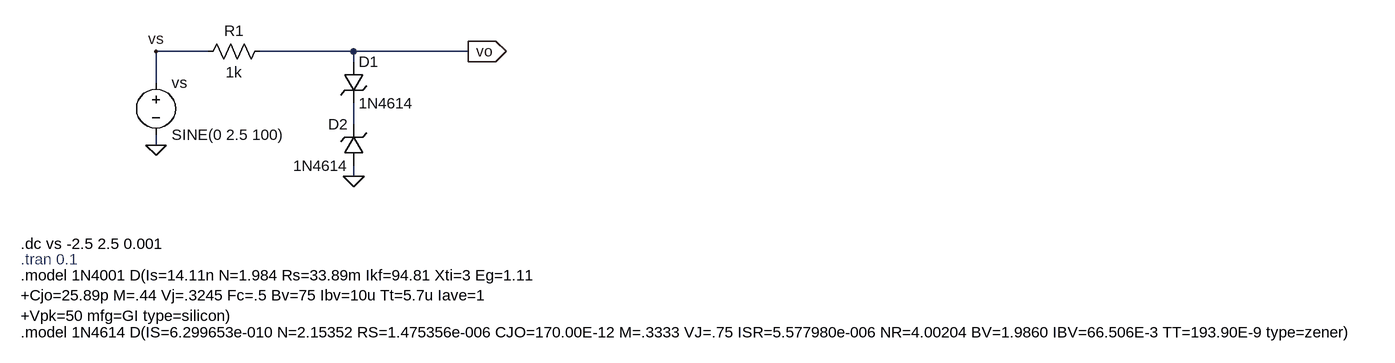
[diagram p0: schematic Lab6p4.asc]
Lab6p4.asc, the LTspice schematic file:
Version 4
SHEET 1 2280 680
WIRE 288 16 208 16
WIRE 512 16 368 16
WIRE 688 16 512 16
WIRE 512 32 512 16
WIRE 208 64 208 16
WIRE 512 128 512 96
WIRE 208 160 208 144
WIRE 512 208 512 192
FLAG 208 160 0
FLAG 688 16 vo
IOPIN 688 16 Out
FLAG 208 16 vs
FLAG 512 208 0
SYMBOL voltage 208 48 R0
WINDOW 123 0 0 Left 0
WINDOW 39 0 0 Left 0
SYMATTR InstName vs
SYMATTR Value SINE(0 2.5 100)
SYMBOL res 384 0 R90
WINDOW 0 0 56 VBottom 2
WINDOW 3 32 56 VTop 2
SYMATTR InstName R1
SYMATTR Value 1k
SYMBOL zener 496 32 R0
SYMATTR InstName D1
SYMATTR Value 1N4614
SYMBOL zener 528 192 R180
WINDOW 0 24 64 Left 2
WINDOW 3 24 0 Left 2
SYMATTR InstName D2
SYMATTR Value 1N4614
TEXT 0 360 Left 2 !.model 1N4001 D(Is=14.11n N=1.984 Rs=33.89m Ikf=94.81 Xti=3 Eg=1.11\n+Cjo=25.89p M=.44 Vj=.3245 Fc=.5 Bv=75 Ibv=10u Tt=5.7u Iave=1\n+Vpk=50 mfg=GI type=silicon)
TEXT 0 336 Left 2 ;.tran 0.1
TEXT 0 312 Left 2 !.dc vs -2.5 2.5 0.001
TEXT 0 448 Left 2 !.model 1N4614 D(IS=6.299653e-010 N=2.15352 RS=1.475356e-006 CJO=170.00E-12 M=.3333 VJ=.75 ISR=5.577980e-006 NR=4.00204 BV=1.9860 IBV=66.506E-3 TT=193.90E-9 type=zener)

The netlist it stands for:
* Lab6p4.asc
vs vs 0 SINE(0 2.5 100)
R1 vo vs 1k
D1 vo N001 1N4614
D2 0 N001 1N4614
.model D D
.lib standard.dio
.model 1N4001 D(Is=14.11n N=1.984 Rs=33.89m Ikf=94.81 Xti=3 Eg=1.11
+Cjo=25.89p M=.44 Vj=.3245 Fc=.5 Bv=75 Ibv=10u Tt=5.7u Iave=1
+Vpk=50 mfg=GI type=silicon)
* .tran 0.1
.dc vs -2.5 2.5 0.001
.model 1N4614 D(IS=6.299653e-010 N=2.15352 RS=1.475356e-006 CJO=170.00E-12 M=.3333 VJ=.75 ISR=5.577980e-006 NR=4.00204 BV=1.9860 IBV=66.506E-3 TT=193.90E-9 type=zener)
.backanno
.end